# Altium schematic sheet external_MCU.SchDoc: RP2040 CNC
size B; Author: AM; CompanyName: Expatria Technologies; DrawnBy: A.Marles; Engineer: AM; Organization: Expatria Technolgoies; DocumentNumber: 7; SheetNumber: 7; SheetTotal: 14
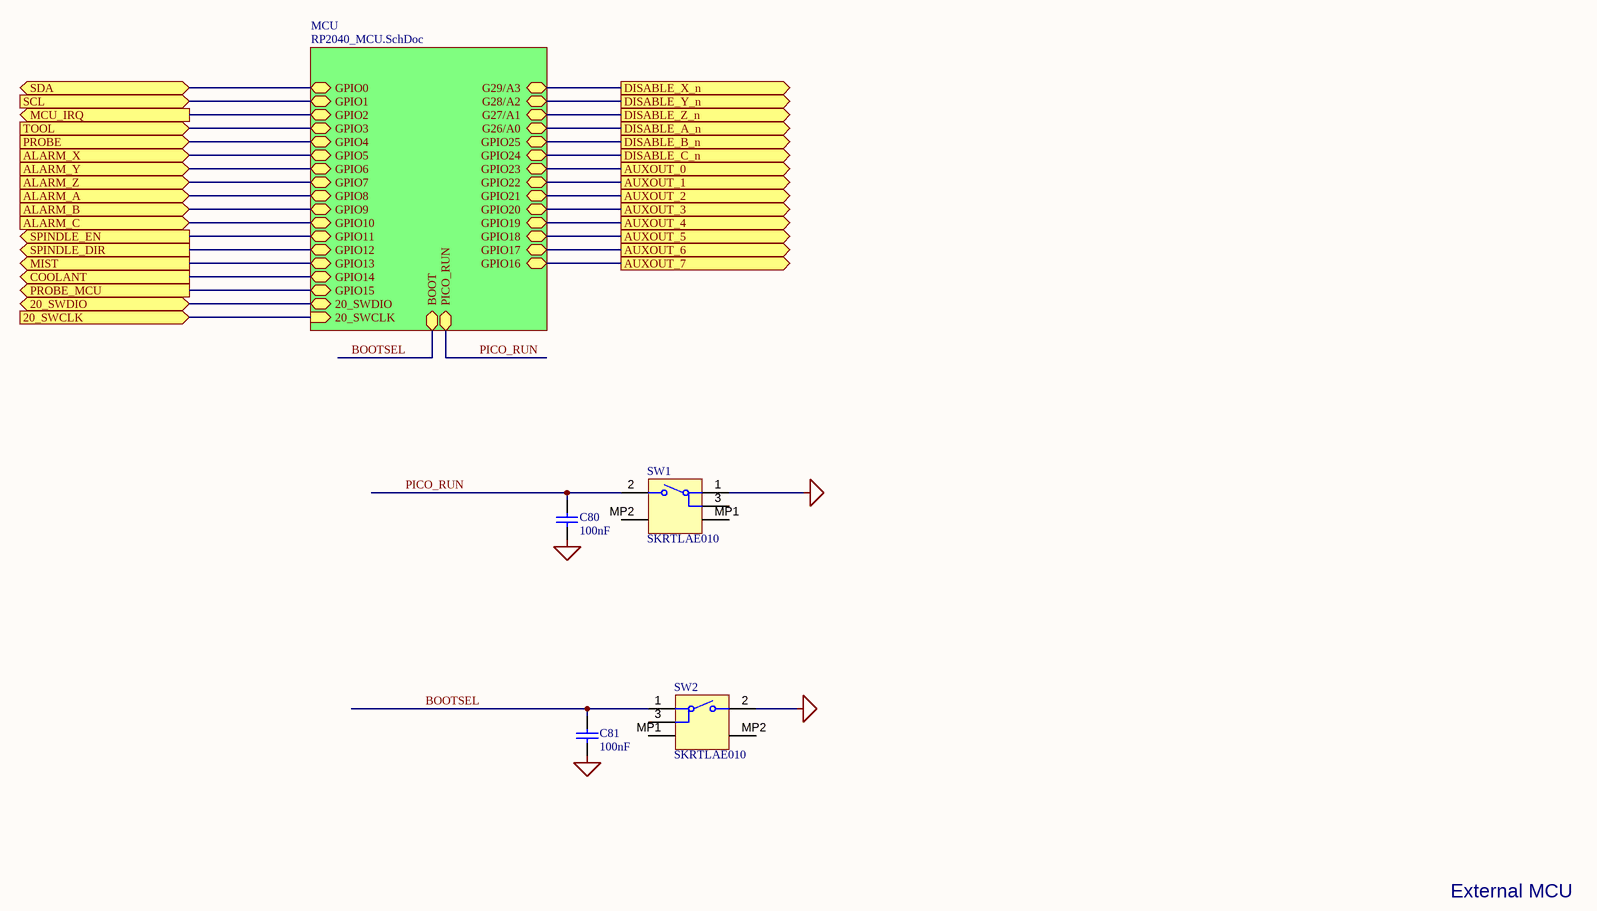
[diagram p0: external_MCU.SchDoc]

## Parts
C80  100nF  [0402_C]
C81  100nF  [0402_C]
SW1  SKRTLAE010  [ALPS-SKRTLAE010_V]
SW2  SKRTLAE010  [ALPS-SKRTLAE010_V]

## Sub-sheets
MCU = RP2040_MCU.SchDoc: G28/A2 (bidir), GPIO20 (bidir), GPIO14 (bidir), GPIO25 (bidir), GPIO15 (bidir), GPIO8 (bidir), GPIO1 (bidir), G27/A1 (bidir), GPIO0 (bidir), GPIO13 (bidir), G26/A0 (bidir), GPIO21 (bidir), PICO_RUN (bidir), G29/A3 (bidir), GPIO7 (bidir), GPIO6 (bidir), GPIO12 (bidir), GPIO2 (bidir), GPIO4 (bidir), GPIO17 (bidir), GPIO10 (bidir), GPIO11 (bidir), GPIO23 (bidir), GPIO22 (bidir), GPIO18 (bidir), GPIO5 (bidir), GPIO9 (bidir), GPIO3 (bidir), GPIO24 (bidir), GPIO19 (bidir), GPIO16 (bidir), BOOT (bidir), 20_SWDIO (bidir), 20_SWCLK (in)

## Ports
20_SWCLK (in), 20_SWDIO (bidir), ALARM_A (in), ALARM_B (in), ALARM_C (in), ALARM_X (in), ALARM_Y (in), ALARM_Z (in), AUXOUT_0 (out), AUXOUT_1 (out), AUXOUT_2 (out), AUXOUT_3 (out), AUXOUT_4 (out), AUXOUT_5 (out), AUXOUT_6 (out), AUXOUT_7 (out), COOLANT (out), DISABLE_A_n (out), DISABLE_B_n (out), DISABLE_C_n (out), DISABLE_X_n (out), DISABLE_Y_n (out), DISABLE_Z_n (out), MCU_IRQ (out), MIST (out), PROBE (in), PROBE_MCU (out), SCL (in), SDA (bidir), SPINDLE_DIR (out), SPINDLE_EN (out), TOOL (in)

## Nets
MCU_GND: C80.1 C81.1 SW1.1 SW2.2
20_SWCLK: port 20_SWCLK, sheet MCU/20_SWCLK
20_SWDIO: port 20_SWDIO, sheet MCU/20_SWDIO
ALARM_A: port ALARM_A, sheet MCU/GPIO8
ALARM_B: port ALARM_B, sheet MCU/GPIO9
ALARM_C: port ALARM_C, sheet MCU/GPIO10
ALARM_X: port ALARM_X, sheet MCU/GPIO5
ALARM_Y: port ALARM_Y, sheet MCU/GPIO6
ALARM_Z: port ALARM_Z, sheet MCU/GPIO7
AUXOUT_0: port AUXOUT_0, sheet MCU/GPIO23
AUXOUT_1: port AUXOUT_1, sheet MCU/GPIO22
AUXOUT_2: port AUXOUT_2, sheet MCU/GPIO21
AUXOUT_3: port AUXOUT_3, sheet MCU/GPIO20
AUXOUT_4: port AUXOUT_4, sheet MCU/GPIO19
AUXOUT_5: port AUXOUT_5, sheet MCU/GPIO18
AUXOUT_6: port AUXOUT_6, sheet MCU/GPIO17
AUXOUT_7: port AUXOUT_7, sheet MCU/GPIO16
BOOTSEL: C81.2 SW2.1 ; sheet MCU/BOOT
COOLANT: port COOLANT, sheet MCU/GPIO14
DISABLE_A_n: port DISABLE_A_n, sheet MCU/G26/A0
DISABLE_B_n: port DISABLE_B_n, sheet MCU/GPIO25
DISABLE_C_n: port DISABLE_C_n, sheet MCU/GPIO24
DISABLE_X_n: port DISABLE_X_n, sheet MCU/G29/A3
DISABLE_Y_n: port DISABLE_Y_n, sheet MCU/G28/A2
DISABLE_Z_n: port DISABLE_Z_n, sheet MCU/G27/A1
MCU_IRQ: port MCU_IRQ, sheet MCU/GPIO2
MIST: port MIST, sheet MCU/GPIO13
PICO_RUN: C80.2 SW1.2 ; sheet MCU/PICO_RUN
PROBE: port PROBE, sheet MCU/GPIO4
PROBE_MCU: port PROBE_MCU, sheet MCU/GPIO15
SCL: port SCL, sheet MCU/GPIO1
SDA: port SDA, sheet MCU/GPIO0
SPINDLE_DIR: port SPINDLE_DIR, sheet MCU/GPIO12
SPINDLE_EN: port SPINDLE_EN, sheet MCU/GPIO11
TOOL: port TOOL, sheet MCU/GPIO3

Not connected (* = marked no-connect by the designer): SW1 3 MP1 MP2; SW2 3 MP1 MP2

## Notes on the sheet
- External MCU
- SHEET
- Expatria Technologies
- 1136 Glade Court
- Port Coquitlam, BC V3B 1R5
- PROJECT
- SIZE
- ENGR
- MODIFIED
- DOCUMENT
- REV
- Copyright Expatria Technologies 2022. This document describes Open Hardware and is licensed under the CERN-OHL-S v2. No warranty is implied or expressed.
- EMAIL: INFO@EXPATRIA.CA
- B
- /

## Library data of the parts
C80 C81 = 0402 100nF (104) 10% 16V: Chip capacitors; Manufacturer: Samsung Electro-Mechanics; PartNumber: CL05B104KO5NNNC; Tolerance: 10%; Voltage: 16V; ComponentLink1Description: Supplier link; ComponentLink1URL: http://www.szlcsc.com/product/details_1877.html; Package: 0402; Supplier: LC; SuppliersPartNumber: C1525; Capacitance: 100nF
SW1 SW2 = CMP-2000-07073-2: Side Push Type, 250 V, -40 to 90 degC, 3-Pin SMD, RoHS, Tape and Reel; Manufacturer: ALPS; Operating Force: 1.6N; Folder: Unified Components\Components\New Releases\New\; Maximum Current Rating: 0.05@12VDCA; RevisionId: 1; Pole Throw Configuration: SPST; Switch Configuration: N.O.; AccessRights: 2147483647; Maximum DC Voltage Rating: 12V; ContentType: Unified Component; Rad Hard: No; Mounting: SurfaceMount; Datasheet URL: http://www.alps.com/prod/info/E/PDF/Tact/SurfaceMount/SKRT/SKRT.PDF; Manufacturer URL: http://www.alps.com/e/; ReleaseDate: 22/09/2017 06:13:25 AM; ItemHRID: CMP-2000-07073; ContentTypeGUID: CB3C11C4-E317-11DF-B822-12313F0024A2; LifeCycle: Released; ItemGUID: EAC55BEC-37DC-4BDB-8BA7-D75E6D5C3D75; Packaging: Tape&Reel; Package Reference: SKRTLAE010; FolderGUID: B7F4506A-9127-42E7-A087-46FE7B18D116; Datasheet Version: 06/2015; Mounting Technology: SurfaceMount; LifeCycleStateGUID: 61E382EE-6656-4F12-9E24-BE9327104A25; Package Description: 3-Pin Surface Mount Device, Body 4.5 x 3.55 mm, Pitch 1.225 mm; SuppliersPartNumber: C110293; Manufacturer 1: ALPS